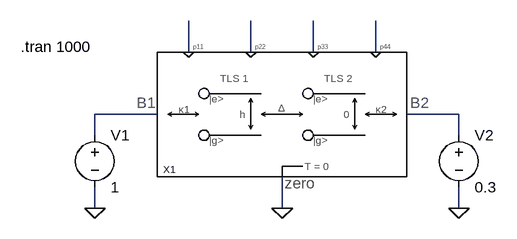
[diagram p0: schematic Test_thermal_rectifier_Werl.asc]
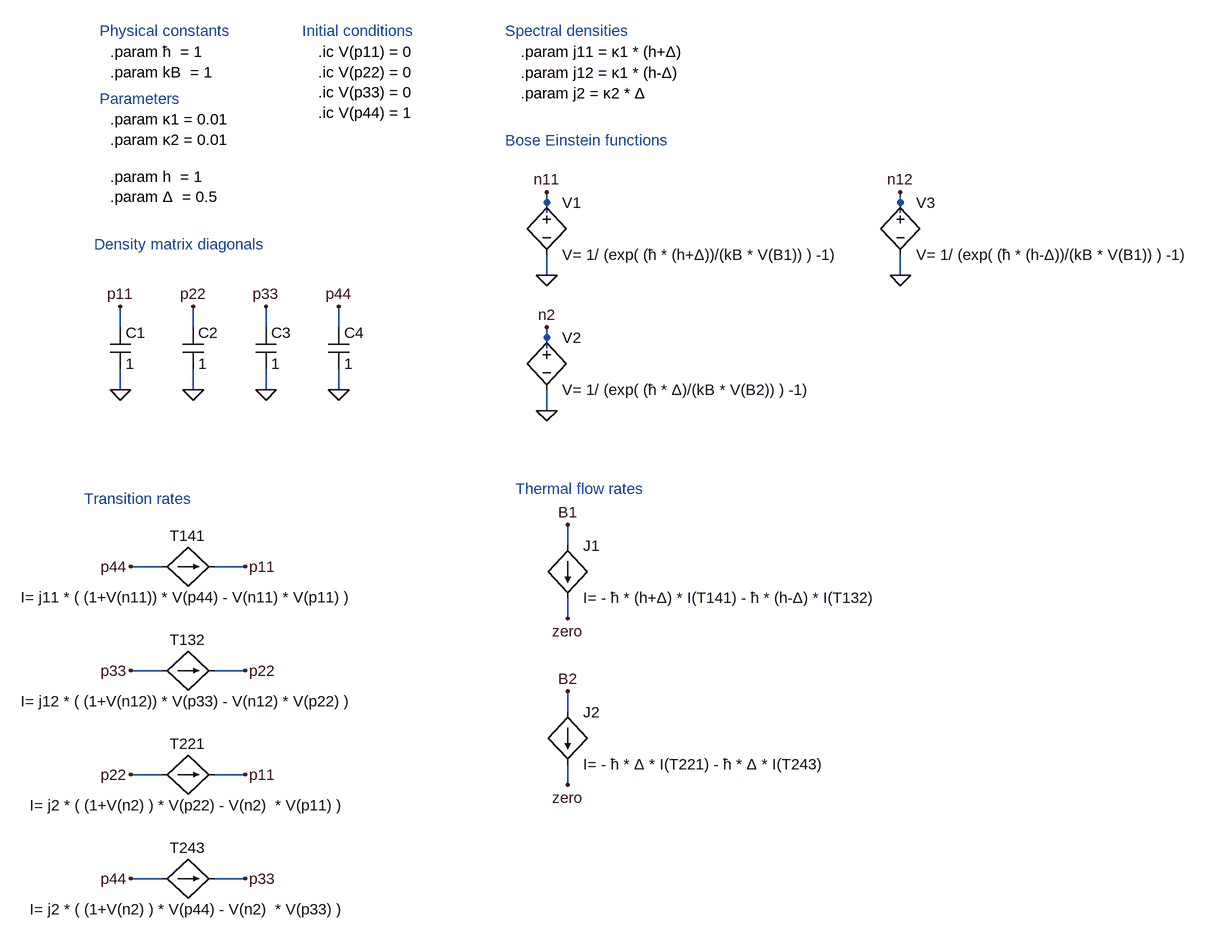
[diagram p1: sub-circuit thermal_rectifier_werl.asc]
Test_thermal_rectifier_Werl.asc, the LTspice schematic file:
Version 4
SHEET 1 880 680
WIRE 80 80 80 32
WIRE 176 80 176 32
WIRE 272 80 272 32
WIRE 368 80 368 32
WIRE 32 176 -64 176
WIRE 496 176 416 176
WIRE -64 208 -64 176
WIRE 496 208 496 176
WIRE -64 320 -64 288
WIRE 224 320 224 272
WIRE 496 320 496 288
FLAG -64 320 0
FLAG 496 320 0
FLAG 224 320 0
SYMBOL thermal_rectifier_Werl -64 32 R0
SYMATTR InstName X1
SYMBOL voltage -64 192 R0
WINDOW 123 0 0 Left 0
WINDOW 39 0 0 Left 0
SYMATTR InstName V1
SYMATTR Value 1
SYMBOL voltage 496 192 R0
WINDOW 123 0 0 Left 0
WINDOW 39 0 0 Left 0
SYMATTR InstName V2
SYMATTR Value 0.3
TEXT -178 72 Left 2 !.tran 1000

thermal_rectifier_werl.asc, the sub-circuit schematic file:
Version 4
SHEET 1 1168 1376
WIRE 32 272 32 256
WIRE 576 272 576 256
WIRE 32 288 32 272
WIRE 576 288 576 272
WIRE 32 384 32 352
WIRE 576 384 576 352
WIRE -624 464 -624 432
WIRE -512 464 -512 432
WIRE -400 464 -400 432
WIRE -288 464 -288 432
WIRE 32 480 32 464
WIRE 32 496 32 480
WIRE -624 560 -624 528
WIRE -512 560 -512 528
WIRE -400 560 -400 528
WIRE -288 560 -288 528
WIRE 32 592 32 560
WIRE 64 800 64 768
WIRE -560 832 -608 832
WIRE -432 832 -480 832
WIRE 64 912 64 880
WIRE -560 992 -608 992
WIRE -432 992 -480 992
WIRE 64 1056 64 1024
WIRE -560 1152 -608 1152
WIRE -432 1152 -480 1152
WIRE 64 1168 64 1136
WIRE -560 1312 -608 1312
WIRE -432 1312 -480 1312
FLAG -624 560 0
FLAG -624 432 p11
FLAG -512 560 0
FLAG -512 432 p22
FLAG -608 832 p44
FLAG -432 832 p11
FLAG -608 992 p33
FLAG -432 992 p22
FLAG 64 768 B1
FLAG 64 1024 B2
FLAG 32 384 0
FLAG 32 256 n11
FLAG 32 592 0
FLAG 32 464 n2
FLAG 64 912 zero
FLAG 64 1168 zero
FLAG 576 384 0
FLAG 576 256 n12
FLAG -400 560 0
FLAG -400 432 p33
FLAG -288 560 0
FLAG -288 432 p44
FLAG -608 1152 p22
FLAG -432 1152 p11
FLAG -608 1312 p44
FLAG -432 1312 p33
SYMBOL cap -640 464 R0
SYMATTR InstName C1
SYMATTR Value 1
SYMBOL cap -528 464 R0
SYMATTR InstName C2
SYMATTR Value 1
SYMBOL bi -560 832 R270
WINDOW 0 32 40 VTop 2
WINDOW 3 -32 40 VBottom 2
SYMATTR InstName T141
SYMATTR Value I= j11 * ( (1+V(n11)) * V(p44) - V(n11) * V(p11) )
SYMBOL bi -560 992 R270
WINDOW 0 32 40 VTop 2
WINDOW 3 -32 40 VBottom 2
SYMATTR InstName T132
SYMATTR Value I= j12 * ( (1+V(n12)) * V(p33) - V(n12) * V(p22) )
SYMBOL bi 64 800 R0
SYMATTR InstName J1
SYMATTR Value I= - ħ * (h+Δ) * I(T141) - ħ * (h-Δ) * I(T132)
SYMBOL bi 64 1056 R0
SYMATTR InstName J2
SYMATTR Value I= - ħ * Δ * I(T221) - ħ * Δ * I(T243)
SYMBOL bv 32 256 R0
SYMATTR InstName V1
SYMATTR Value V= 1/ (exp( (ħ * (h+Δ))/(kB * V(B1)) ) -1)
SYMBOL bv 32 464 R0
SYMATTR InstName V2
SYMATTR Value V= 1/ (exp( (ħ * Δ)/(kB * V(B2)) ) -1)
SYMBOL bv 576 256 R0
SYMATTR InstName V3
SYMATTR Value V= 1/ (exp( (ħ * (h-Δ))/(kB * V(B1)) ) -1)
SYMBOL cap -416 464 R0
SYMATTR InstName C3
SYMATTR Value 1
SYMBOL cap -304 464 R0
SYMATTR InstName C4
SYMATTR Value 1
SYMBOL bi -560 1152 R270
WINDOW 0 32 40 VTop 2
WINDOW 3 -32 40 VBottom 2
SYMATTR InstName T221
SYMATTR Value I= j2 * ( (1+V(n2) ) * V(p22) - V(n2)  * V(p11) )
SYMBOL bi -560 1312 R270
WINDOW 0 32 40 VTop 2
WINDOW 3 -32 40 VBottom 2
SYMATTR InstName T243
SYMATTR Value I= j2 * ( (1+V(n2) ) * V(p44) - V(n2)  * V(p33) )
TEXT -320 40 Left 2 !.ic V(p11) = 0\n.ic V(p22) = 0\n.ic V(p33) = 0\n.ic V(p44) = 1
TEXT -32 8 Left 2 ;Spectral densities
TEXT -8 40 Left 2 !.param j11 = κ1 * (h+Δ)
TEXT -8 72 Left 2 !.param j12 = κ1 * (h-Δ)
TEXT -344 8 Left 2 ;Initial conditions
TEXT -664 336 Left 2 ;Density matrix diagonals
TEXT -680 728 Left 2 ;Transition rates
TEXT -16 712 Left 2 ;Thermal flow rates
TEXT -656 112 Left 2 ;Parameters
TEXT -640 144 Left 2 !.param κ1 = 0.01\n.param κ2 = 0.01
TEXT -640 232 Left 2 !.param h  = 1\n.param Δ  = 0.5
TEXT -640 40 Left 2 !.param ħ  = 1\n.param kB  = 1
TEXT -656 8 Left 2 ;Physical constants
TEXT -32 176 Left 2 ;Bose Einstein functions
TEXT -8 104 Left 2 !.param j2 = κ2 * Δ

The netlist it stands for:
* Test_thermal_rectifier_Werl.asc
XX1 N005 N006 0 N001 N002 N003 N004 thermal_rectifier_werl params: ħ=1, kB=1, κ1=0.01, κ2=0.01, h=1, Δ=0.5
V1 N005 0 1
V2 N006 0 0.3

* block symbol definitions
.subckt thermal_rectifier_werl B1 B2 zero p11 p22 p33 p44
C1 p11 0 1
C2 p22 0 1
B§T141 p44 p11 I= j11 * ( (1+V(n11)) * V(p44) - V(n11) * V(p11) )
B§T132 p33 p22 I= j12 * ( (1+V(n12)) * V(p33) - V(n12) * V(p22) )
B§J1 B1 zero I= - ħ * (h+Δ) * I(T141) - ħ * (h-Δ) * I(T132)
B§J2 B2 zero I= - ħ * Δ * I(T221) - ħ * Δ * I(T243)
B§V1 n11 0 V= 1/ (exp( (ħ * (h+Δ))/(kB * V(B1)) ) -1)
B§V2 n2 0 V= 1/ (exp( (ħ * Δ)/(kB * V(B2)) ) -1)
B§V3 n12 0 V= 1/ (exp( (ħ * (h-Δ))/(kB * V(B1)) ) -1)
C3 p33 0 1
C4 p44 0 1
B§T221 p22 p11 I= j2 * ( (1+V(n2) ) * V(p22) - V(n2)  * V(p11) )
B§T243 p44 p33 I= j2 * ( (1+V(n2) ) * V(p44) - V(n2)  * V(p33) )
.ic V(p11) = 0
.ic V(p22) = 0
.ic V(p33) = 0
.ic V(p44) = 1
* Spectral densities
.param j11 = κ1 * (h+Δ)
.param j12 = κ1 * (h-Δ)
* Initial conditions
* Density matrix diagonals
* Transition rates
* Thermal flow rates
* Parameters
.param κ1 = 0.01
.param κ2 = 0.01
.param h  = 1
.param Δ  = 0.5
.param ħ  = 1
.param kB  = 1
* Physical constants
* Bose Einstein functions
.param j2 = κ2 * Δ
.ends thermal_rectifier_werl

.tran 1000
.backanno
.end